# EAGLE design capacitive_touch_board_RIGHT (EAGLE 9.3.0)
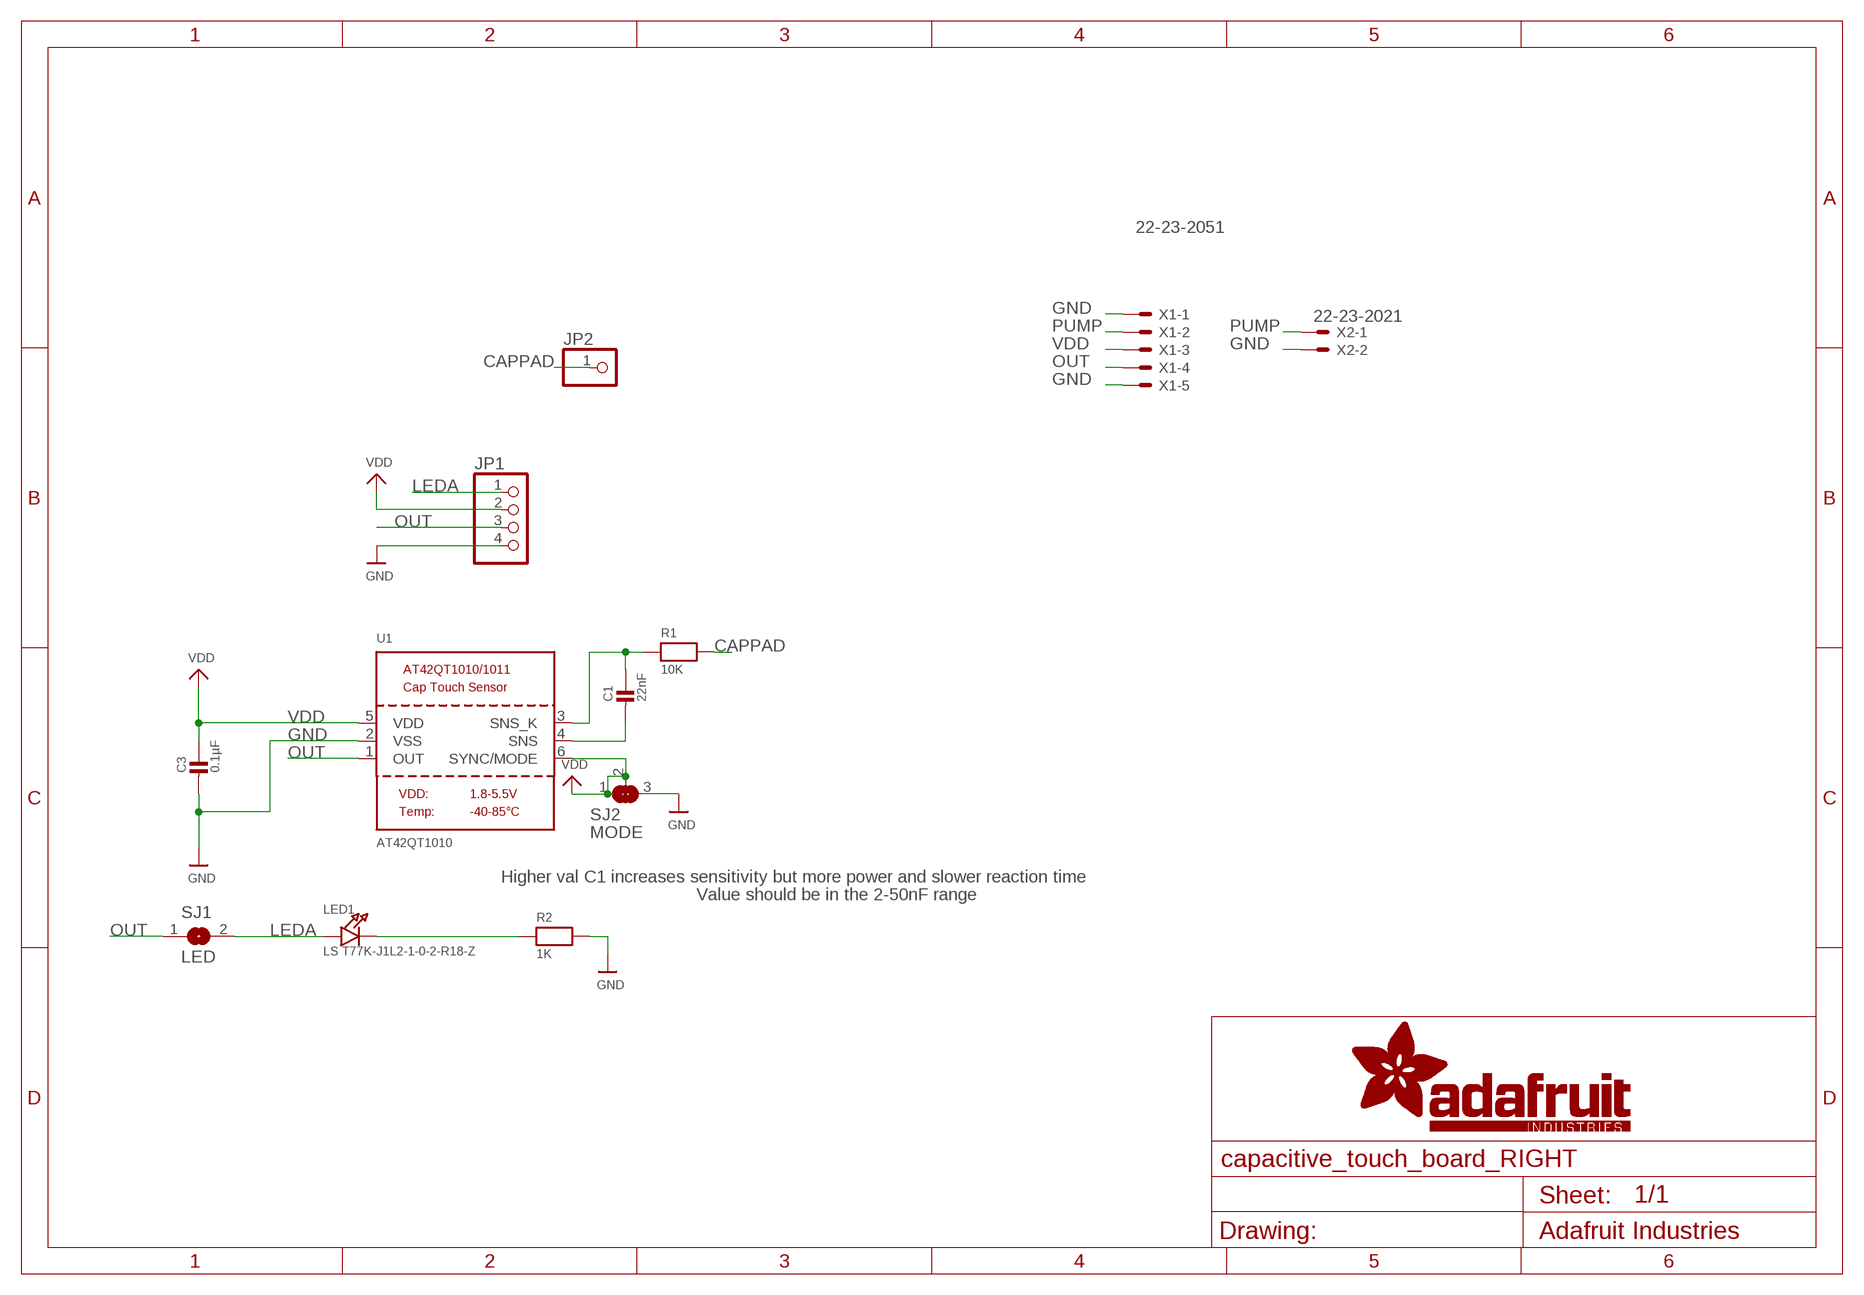
[diagram p0: schematic, sheet 1]

## Parts
C1  22nF  CAP_CERAMIC_0805  [_0805]
C3  0.1µF  CAP_CERAMIC_0805  [_0805]
JP1  HEADER-1X476MIL  [1X04_ROUND_76]
JP2  PINHD-1X1  [1X01]
LED1  LS T77K-J1L2-1-0-2-R18-Z  LEDPLCC2_REV  [PLCC2_REVMOUNT]
R1  10K  RESISTOR_0805  [_0805]
R2  1K  RESISTOR_0805  [_0805]
SJ1  LED  SOLDERJUMPERCLOSED  [SOLDERJUMPER_CLOSEDWIRE]
SJ2  MODE  SOLDERJUMPER_2WAY  [SOLDERJUMPER_2WAY_OPEN_NOPASTE]
U1  AT42QT1010  AT42QT1010/1  [SOT23-6]
X1  22-23-2051  [22-23-2051]
X2  22-23-2021  [22-23-2021]

## Nets
CAPPAD: JP2.1 R1.2
GND: C3.2 JP1.4 R2.2 SJ2.3 U1.2(VSS) X1.1 X1.5 X2.2
LEDA: JP1.1 LED1.A SJ1.2
N$3: C1.2 U1.4(SNS)
N$4: C1.1 R1.1 U1.3(SNS_K)
N$6: LED1.K(C) R2.1
OUT: JP1.3 SJ1.1 U1.1(OUT) X1.4
PUMP: X1.2 X2.1
VDD: C3.1 JP1.2 SJ2.1 SJ2.2 U1.5(VDD) U1.6(SYNC/MODE) X1.3

## Notes on the sheet
- Higher val C1 increases sensitivity but more power and slower reaction time
- Value should be in the 2-50nF range

## Library data of the parts
C1 C3 = microbuilder:CAP_CERAMIC: Ceramic Capacitors For new designs, use the packages preceded by an '_' character since they are more reliable: The following footprints should be used on most boards: _0402 - Standard footprint for regular board layouts _0603 - Standard footprint for regular board layouts _0805 - Standard footprint for regular board layouts For extremely tight-pitch boards where space is at a premium, the following 'micro-pitch' footprints can be used (smaller pads, no silkscreen outline, etc.): _0402MP - Micro-pitch footprint for very dense/compact boards _0603MP - Micro-pitch footprint for very dense/compact boards _0805MP - Micro-pitch footprint for very dense/compact boards Commonly Stocked Parts 0402 - 0402 Surface Mount Capacitors 16pF 50V 5% [Digikey: 445-4899-2-ND] 18pF 50V 5% [Digikey: 490-1281-2-ND] 22pF 50V 5% [Digikey: 490-1283-2-ND] 68pF 50V 5% [Digikey: 490-1289-2-ND] 0.1uF 10V 10% [Digikey: 490-1318-2-ND] 1.0uF 6.3V 10% [Digikey: 490-1320-2-ND] 0603 - 0603 Surface Mount Capacitors 16 pF 50V 5% [Digikey: 445-5051-2-ND] 22 pF 50V [Digikey: PCC220ACVTR-ND] 33 pF 50V 5% [Digikey: 490-1415-1-ND] 56pF 50V 5% [Digikey: 490-1421-1-ND] 220pF 50V 5% [Digikey: 445-1285-1-ND] 680 pF 50V 2200 pF 50V 5% C0G [Digikey: 445-1297-1-ND] 5600 pF 100V 5% X7R [Digikey: 478-3711-1-ND] 0.1 µF 25V 10% [Digikey: PCC2277TR-ND] 0.22 µF 16V 10% X7R [Digikey: 445-1318-1-ND] 1.0 µF 25V 10% [Digikey: 445-5146-2-ND] 0603 - RF Specific 3pF 250V +/-0.1pF RF [Digikey: 712-1347-1-ND] 18 pF 250V 5% [Digikey: 478-3505-1-ND or 712-1322-1-ND] 56 pF 250V 5% C0G RF [Digikey: 490-4867-1-ND] 68 pF 250V RF [Digikey: 490-4868-1-ND] 0805 - 0805 Surface Mount Capacitors 220 pF 250V 2% RF Ceramic Capacitor [Digikey: 712-1398-1-ND] 1000 pF 50V 2% NP0 Ceramic Capacitor [Digikey: 478-3760-1-ND] 0.1 µF 25V 10% Ceramic Capacitor [Digikey: PCC1828TR-ND] 1.0 µF 16V 10% Ceramic Capacitor[Digikey: 490-1691-2-ND] 10.0 µF 10V 10% Ceramic Capacitor[Digikey: 709-1228-1-ND] 10.0 uF 16V 10% Ceramic Capacitor [Digikey: 478-5165-2-ND] 47 uF 6.3V 20% Ceramic Capacitor [Digikey: 587-1779-1-ND or 399-5506-1-ND] 1206 - 1206 Surface Mount Capacitors 47uF 10V 20% Ceramic Capacitor [Digikey: 490-5528-1-ND or 399-5508-1-ND or 445-6010-1-ND] 100uF 6.3V -20%, +80% Y5V Ceramic Capacitor (Digikey: 490-4512-1-ND, Mouser: 81-GRM31CF50J107ZE1L)
JP1 = microbuilder:HEADER-1X4: PIN HEADER
JP2 = pinhead:PINHD-1X1: PIN HEADER
LED1 = microbuilder:LED: LED 0603 - 0603 Surface Mount Package 2mA: Green LED - Low Power (3.9mcd, 2ma, 1.7Vf) - Digikey: 475-2709-2-ND Orange LED - Low Power (9.8mcd, 2ma, 1.8Vf) - Digikey: 475-1194-2-ND Red LED - Low Power (5mcd, 2ma, 1.8Vf) - Digikey: 475-1195-2-ND Yellow LED - Low Power (7mcd, 2ma, 1.8Vf) - Digikey: 475-1196-2-ND 5mA: Blue LED - Low Power (17mcd, 5ma, 2.9Vf) - Digikey: LNJ937W8CRACT-ND 0805 - 0805 Surface Mount Package 2mA: Red LED (8.8mcd, 2mA, 1.8Vf, Clear) - Low Power [Digikey: 475-2510-1-ND] Green LED (5mcd, 2mA, 1.8Vf, Clear) - Low Power [Digikey: 475-2730-1-ND] Yellow LED (11.3mcd, 2mA, 1.8Vf, Clear) - Low Power [Digikey: 475-2555-1-ND] 20mA: Red LED (104mcd, 20mA, Diffused) - LS R976 [Digikey: 475-1278-6-ND] Red LED (12mcd, 20mA, 2.0Vf, Clear) - APT2012EC [Digikey: 754-1128-1-ND] Green LED (15mcd, 20mA, 2.2Vf, Clear) - APT2012GC [Digikey: 754-1131-1-ND] Orange LED (160mcd, 20mA, 2.1Vf, Clear) - APT2012SECK [Digikey: 754-1130-1-ND] 1206 - 1206 Surface Mount Package Green LED (26mcd, 20mA, Diffused) - LG N971 [Digikey: 475-1407-6-ND] Red LED (15mcd, 20mA, Diffused) - LH N974 [Digikey: 475-1416-6-ND] Cree - Cree High-Power Surface Mount LEDs XPEBWT-L1-0000-00D50 - White 111lm 350mA 2.9Vf 6200K 110° XTEAWT-00-0000-00000LEE3 - White 114lm 350mA 2.85Vf 5000K 115° Everlight - Everlight 45-21 Series Surface Mount LEDs 45-21/QK2C-B2832AC2CB2/2T - Warm White 2000mcd 20mA 3.25Vf 3050K 120° 45-21/LK2C-B38452C4CB2/2T - Nuetral White 2000mcd 20mA 3.25Vf 4150K 120° 45-21/LK2C-B50634C6CB2/2T - Cold White 2200mcd 20mA 3.25Vf 5650K 120° PLCC2 Reverse Mount LS T77K-J1L2-1-0-2-R18-Z - Red 11.25mcd 2mA 1.8Vf 630nm 120° LO T77K-L1M2-24-Z - Orange 19.6mcd 2mA 1.8Vf 606nm 120° LY T77K-K2M1-26-Z - Yellow 15.7mcd 2mA 1.8Vf 587nm 120°
R1 R2 = microbuilder:RESISTOR: Resistors For new designs, use the packages preceded by an '_' character since they are more reliable: The following footprints should be used on most boards: _0402 - Standard footprint for regular board layouts _0603 - Standard footprint for regular board layouts _0805 - Standard footprint for regular board layouts For extremely tight-pitch boards where space is at a premium, the following 'micro-pitch' footprints can be used (smaller pads, no silkscreen outline, etc.): _0402MP - Micro-pitch footprint for very dense/compact boards _0603MP - Micro-pitch footprint for very dense/compact boards _0805MP - Micro-pitch footprint for very dense/compact boards
SJ1 = microbuilder:SOLDERJUMPER: SMD Solder JUMPER Solder the two pads together to create a connection, or remove the solder to break it. REFLOW - Use this footprint for solder paste and reflow ovens. WAVE - Use this footprint for hand-soldering (larger pads). CLOSED - Has a trace between the two pads to ensure it is closed by default. The trace needs to be cut to disable the jumper, and can be closed again by creating a solder bridge between the two pads.
SJ2 = microbuilder:SOLDERJUMPER_2WAY: 2-Way Solder Jumper
U1 = microbuilder:AT42QT1010/1: AT42QT1010/1011 - Single Button Cap Touch Sensors AT42QT1010 - Auto recalibration AT42QT1011 - Remains on as long as touch is detected
X1 = con-molex:22-23-2051: .100" (2.54mm) Center Header - 5 Pin; MF: MOLEX; MPN: 22-23-2051; OC_FARNELL: 1462952; OC_NEWARK: 38C9178
X2 = con-molex:22-23-2021: .100" (2.54mm) Center Header - 2 Pin; MF: MOLEX; MPN: 22-23-2021; OC_FARNELL: 1462926; OC_NEWARK: 25C3832

## Board
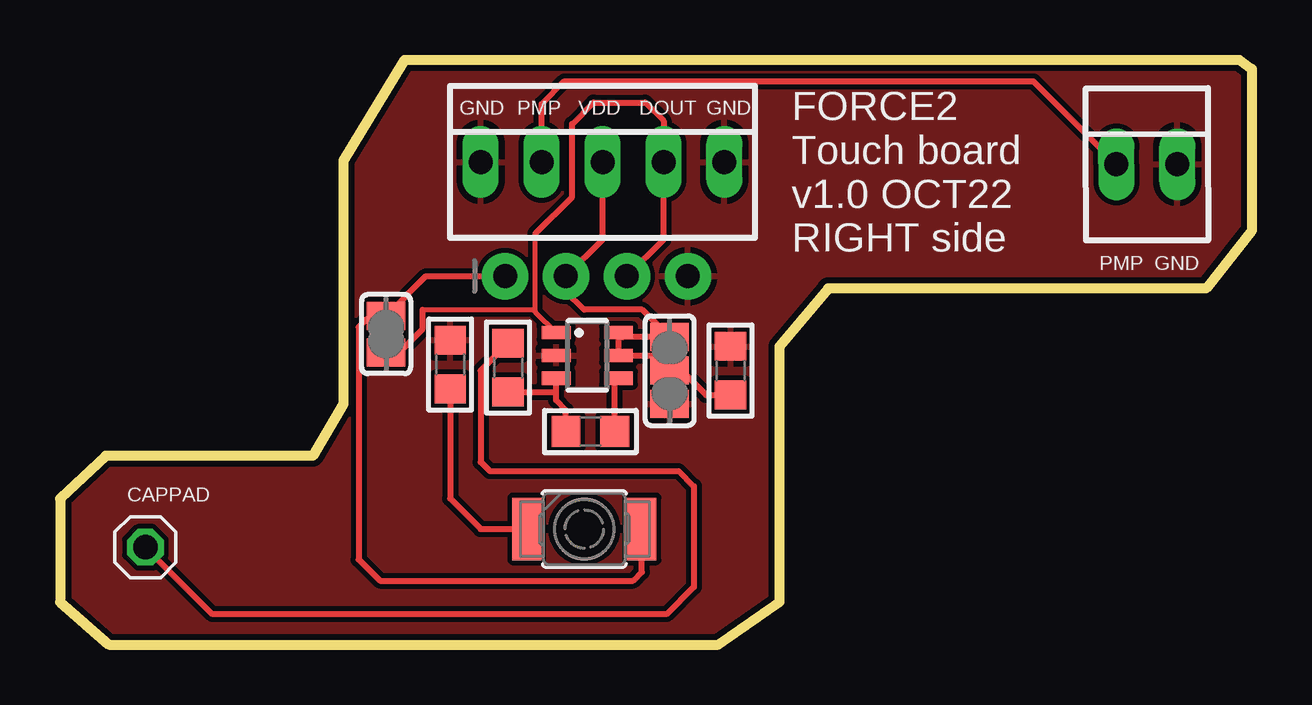
[diagram p1: board, top side]
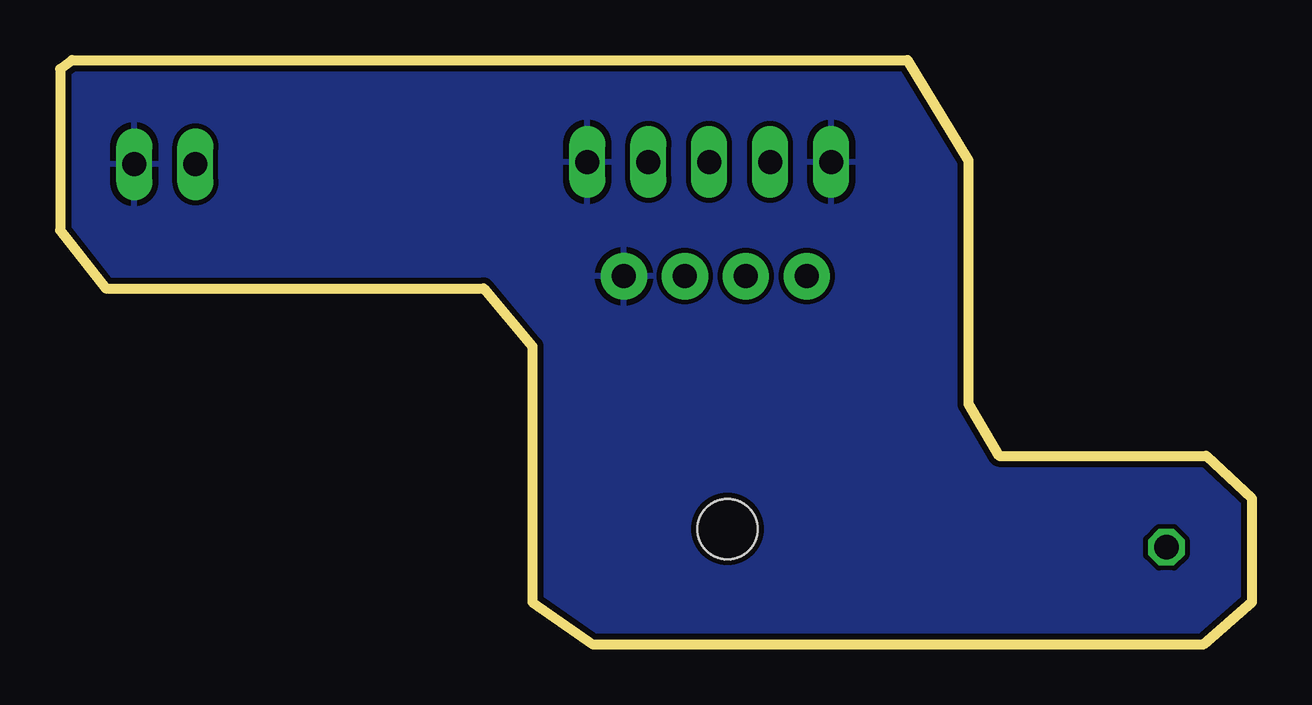
[diagram p2: board, bottom side, seen from below]

Size 49.66 x 24.38 mm. Coordinates in mm from the lower left corner, seen from the top.
Outline: 49.15,24.38 49.66,24 49.66,17.27 47.75,14.86 32,14.86 29.97,12.45 29.97,1.78 27.43,0 2.03,0 0,1.78 0,6.1 1.91,7.87 10.54,7.87 11.81,10.03 11.81,20.19 14.35,24.38 49.15,24.38
Copper layers (1*16): Top 0.035mm / dielectric 1.5mm / Bottom 0.035mm
Design rules "adafruit *": minimum track width 8mil, minimum drill 16mil, track to track 8mil, track to pad 8mil, pad to pad 8mil, via to via 8mil, smd to smd 8mil, copper to edge 10mil, drill to drill 8mil, minimum pad ring 10mil, minimum via ring 8mil, stop-mask expansion 4mil, vias tented up to drill 20mil, thermal gap 10mil
tRestrict: area -37.3,-1 to -25.8,11

### Footprints (pad centres in the part's own frame; a part is rotated, then mirrored left to right if it is on the bottom)
_0805 = smd 1.2 x 1.3: 1 -1.016,0; 2 1.016,0
1X04_ROUND_76 = drill 1 pad 1.93: 1 -3.81,0; 2 -1.27,0; 3 1.27,0; 4 3.81,0
1X01 = drill 1.016 octagon: 1 0,0
PLCC2_REVMOUNT = smd 1.2 x 2.6: A 2.4,0; K -2.4,0 | hole 2.5: 0,0
SOLDERJUMPER_CLOSEDWIRE = smd 1.168 x 1.6: 1 -0.762,0; 2 0.762,0 | smd 0.635 x 0.203: WIRE 0,0
SOLDERJUMPER_2WAY_OPEN_NOPASTE = smd 1.168 x 1.6: 1 -1.397,0; 2 0,0; 3 1.397,0
SOT23-6 = smd 0.55 x 1.2: 1 -0.95,-1.3; 2 0,-1.3; 3 0.95,-1.3; 4 0.95,1.3; 5 0,1.3; 6 -0.95,1.3
22-23-2051 = drill 1 long: 1 -5.08,0; 2 -2.54,0; 3 0,0; 4 2.54,0; 5 5.08,0
22-23-2021 = drill 1 long: 1 -1.27,0; 2 1.27,0

### Placement (x,y rotation side)
C1  22.1,8.89 0 top
C3  27.94,11.43 90 top
JP1  22.35,15.37 0 top
JP2  3.56,4.06 0 top
LED1  21.84,4.83 0 top
R1  18.67,11.56 90 top
R2  16.26,11.68 90 top
SJ1  13.59,12.95 90 top
SJ2  25.4,11.43 270 top
U1  21.97,12.06 270 top
X1  22.61,20.13 0 top
X2  45.29,20.03 0.1 top

### Tracks (layer width: path | path; a pad name or v marks a point on that pad's centre or on a via)
CAPPAD
  Top 0.254: R1.2 17.53,11.43 17.53,7.62 17.91,7.24 25.78,7.24 26.42,6.6 26.42,2.41 25.27,1.27 6.35,1.27 JP2.1
GND
  pour Top: -3.12,28.96 47.88,28.96 50.67,26.16 50.67,9.91 34.29,-6.48 2.03,-6.48 -5.2,0.76
  pour Bottom: -5.08,26.67 47.75,26.67 50.55,23.88 50.55,9.78 30.48,-10.29 29.72,-9.53 1.91,-9.53 -5.59,-2.03 -5.59,26.16
LEDA
  Top 0.254: JP1.1 15.24,15.37 SJ1.2 13.45,13.58 12.78,13.58 12.45,13.24 12.45,3.56 13.34,2.67 23.88,2.67 24.24,3.04 LED1.A
N$3
  Top 0.254: C1.2 23.11,10.96 U1.4
N$4
  Top 0.254: C1.1 21.08,9.78 20.67,10.19 20.67,10.54 | 20.67,10.54 U1.3 | R1.1 20.67,10.54
N$6
  Top 0.254: R2.1 16.26,6.1 17.53,4.83 LED1.K
OUT
  Top 0.203: 19.81,13.87 19.72,13.97 15.11,13.97 | 19.81,13.87 U1.1 | 19.81,13.87 19.81,17.14
  Top 0.254: JP1.3 25.15,16.89 X1.4 25.15,21.84 24.38,22.61 22.22,22.61 21.34,21.72 21.34,18.67 19.81,17.14 | SJ1.1 13.73,12.33 14.27,12.33 15.11,13.17 15.11,13.97 | U1.1 20.67,13.14
PUMP
  Top 0.254: X1.2 20.07,22.54 21.02,23.49 40.56,23.49 X2.1
VDD
  Top 0.254: X1.3 22.61,16.89 JP1.2 21.08,14.73 21.84,13.97 24.26,13.97 SJ2.1 23.46,12.83 23.29,13 | 23.29,13 U1.6 | 23.29,13 23.27,12.98 U1.5 24.77,12.06 SJ2.2 25.91,11.43 26.92,10.41 C3.1

### Text on the board
bPlace: AT42QT1010 | LEDA | VDD | OUT | GND
tNames: GND | PMP | VDD | DOUT | GND | FORCE2 / Touch board / v1.0 OCT22 / RIGHT side | PMP | GND | CAPPAD